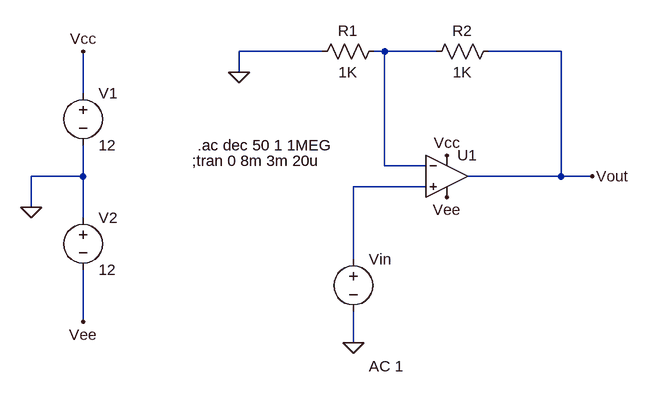
[diagram p0: schematic Draft4.asc]
Draft4.asc, the LTspice schematic file:
Version 4
SHEET 1 1000 680
WIRE 512 16 384 16
WIRE 608 16 592 16
WIRE 688 16 608 16
WIRE 880 16 768 16
WIRE 384 48 384 16
WIRE 144 80 144 16
WIRE 608 192 608 16
WIRE 672 192 608 192
WIRE 144 208 144 160
WIRE 144 208 64 208
WIRE 880 208 880 16
WIRE 880 208 736 208
WIRE 928 208 880 208
WIRE 672 224 560 224
WIRE 64 256 64 208
WIRE 144 272 144 208
WIRE 560 336 560 224
WIRE 144 432 144 352
WIRE 560 464 560 416
FLAG 64 256 0
FLAG 144 16 Vcc
FLAG 144 432 Vee
FLAG 384 48 0
FLAG 928 208 Vout
FLAG 560 464 0
FLAG 704 240 Vee
FLAG 704 176 Vcc
SYMBOL voltage 144 64 R0
WINDOW 123 0 0 Left 0
WINDOW 39 0 0 Left 0
SYMATTR InstName V1
SYMATTR Value 12
SYMBOL voltage 144 256 R0
WINDOW 123 0 0 Left 0
WINDOW 39 0 0 Left 0
SYMATTR InstName V2
SYMATTR Value 12
SYMBOL res 608 0 R90
WINDOW 0 0 56 VBottom 2
WINDOW 3 32 56 VTop 2
SYMATTR InstName R1
SYMATTR Value 1K
SYMBOL res 784 0 R90
WINDOW 0 0 56 VBottom 2
WINDOW 3 32 56 VTop 2
SYMATTR InstName R2
SYMATTR Value 1K
SYMBOL OpAmps\\UniversalOpamp2 704 208 R0
SYMATTR InstName U1
SYMBOL voltage 560 320 R0
WINDOW 3 24 152 Left 2
WINDOW 123 24 180 Left 2
WINDOW 39 0 0 Left 0
SYMATTR InstName Vin
SYMATTR Value ""
SYMATTR Value2 AC 1
TEXT 312 184 Left 2 !;tran 0 8m 3m 20u
TEXT 320 160 Left 2 !.ac dec 50 1 1MEG

The netlist it stands for:
* Draft4.asc
V1 Vcc 0 12
V2 0 Vee 12
R1 N001 0 1K
R2 Vout N001 1K
XU1 N002 N001 Vcc Vee Vout level.2 Avol=1Meg GBW=10Meg Slew=10Meg ilimit=25m rail=0 Vos=0 phimargin=45 en=0 enk=0 in=0 ink=0 Rin=500Meg  ; pins IN+ IN- V+ V- OUT
Vin N002 0 AC 1
;tran 0 8m 3m 20u
.ac dec 50 1 1MEG
.lib UniversalOpamps2.sub
.backanno
.end